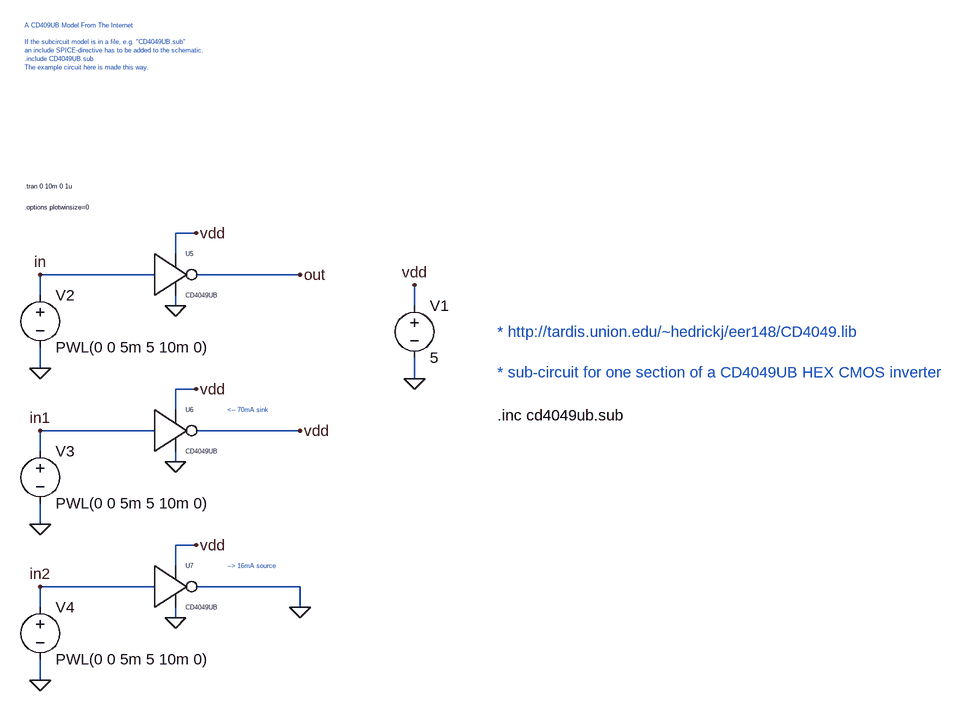
[diagram p0: schematic CD4049UB_test.asc]
CD4049UB_test.asc, the LTspice schematic file:
Version 4
SHEET 1 1844 876
WIRE 368 -256 336 -256
WIRE 336 -224 336 -256
WIRE 304 -192 128 -192
WIRE 528 -192 368 -192
WIRE 128 -160 128 -192
WIRE 336 -144 336 -160
WIRE 704 -144 704 -176
WIRE 128 -48 128 -80
WIRE 704 -32 704 -64
WIRE 368 -16 336 -16
WIRE 336 16 336 -16
WIRE 304 48 128 48
WIRE 528 48 368 48
WIRE 128 80 128 48
WIRE 336 96 336 80
WIRE 128 192 128 160
WIRE 368 224 336 224
WIRE 336 256 336 224
WIRE 304 288 128 288
WIRE 528 288 368 288
WIRE 128 320 128 288
WIRE 528 320 528 288
WIRE 336 336 336 320
WIRE 128 432 128 400
FLAG 704 -32 0
FLAG 704 -176 vdd
FLAG 128 -48 0
FLAG 528 -192 out
FLAG 128 -192 in
FLAG 128 192 0
FLAG 528 48 vdd
FLAG 128 48 in1
FLAG 128 432 0
FLAG 128 288 in2
FLAG 528 320 0
FLAG 336 -144 0
FLAG 368 -256 vdd
FLAG 336 96 0
FLAG 368 -16 vdd
FLAG 336 336 0
FLAG 368 224 vdd
SYMBOL voltage 704 -160 R0
SYMATTR InstName V1
SYMATTR Value 5
SYMBOL voltage 128 -176 R0
WINDOW 123 0 0 Left 0
WINDOW 39 0 0 Left 0
SYMATTR InstName V2
SYMATTR Value PWL(0 0 5m 5 10m 0)
SYMBOL voltage 128 64 R0
WINDOW 123 0 0 Left 0
WINDOW 39 0 0 Left 0
SYMATTR InstName V3
SYMATTR Value PWL(0 0 5m 5 10m 0)
SYMBOL voltage 128 304 R0
WINDOW 123 0 0 Left 0
WINDOW 39 0 0 Left 0
SYMATTR InstName V4
SYMATTR Value PWL(0 0 5m 5 10m 0)
SYMBOL buffer_inv1 320 -192 R0
SYMATTR InstName U5
SYMATTR Value CD4049UB
SYMBOL buffer_inv1 320 48 R0
SYMATTR InstName U6
SYMATTR Value CD4049UB
SYMBOL buffer_inv1 320 288 R0
SYMATTR InstName U7
SYMATTR Value CD4049UB
TEXT 104 -328 Left 0 !.tran 0 10m 0 1u
TEXT 104 -296 Left 0 !.options plotwinsize=0
TEXT 416 256 Left 0 ;--> 16mA source
TEXT 416 16 Left 0 ;<-- 70mA sink
TEXT 104 -576 Left 0 ;A CD409UB Model From The Internet\n \nIf the subcircuit model is in a file, e.g. "CD4049UB.sub"\nan include SPICE-directive has to be added to the schematic. \n.include CD4049UB.sub\nThe example circuit here is made this way.
TEXT 832 -104 Left 2 ;* http://tardis.union.edu/~hedrickj/eer148/CD4049.lib\n \n* sub-circuit for one section of a CD4049UB HEX CMOS inverter
TEXT 832 24 Left 2 !.inc cd4049ub.sub

The netlist it stands for:
* CD4049UB_test.asc
V1 vdd 0 5
V2 in 0 PWL(0 0 5m 5 10m 0)
V3 in1 0 PWL(0 0 5m 5 10m 0)
V4 in2 0 PWL(0 0 5m 5 10m 0)
XU5 in out vdd 0 CD4049UB  ; pins IN OUT VCC VSS
XU6 in1 vdd vdd 0 CD4049UB  ; pins IN OUT VCC VSS
XU7 in2 0 vdd 0 CD4049UB  ; pins IN OUT VCC VSS
.tran 0 10m 0 1u
.options plotwinsize=0
* --> 16mA source
* <-- 70mA sink
* A CD409UB Model From The Internet
* If the subcircuit model is in a file, e.g. "CD4049UB.sub"
* an include SPICE-directive has to be added to the schematic.
* .include CD4049UB.sub
* The example circuit here is made this way.
* * http://tardis.union.edu/~hedrickj/eer148/CD4049.lib
* * sub-circuit for one section of a CD4049UB HEX CMOS inverter
.inc cd4049ub.sub
.backanno
.end